# Altium schematic sheet MIXR Power - 5V & 3V3 Regulators.SchDoc: MIXR Power - +5V, 3V3, -5V Regulators
size B; Organization: Midnight Sun Solar Rayce Car Team; Address1: University of Waterloo; Address2: 200 University Ave W; Address3: Waterloo, ON, Canada; Address4: N2L 3E9; DocumentNumber: 6; SheetNumber: 6; SheetTotal: 8; Website: www.uwmidsun.com; ProjectName: ProjectName
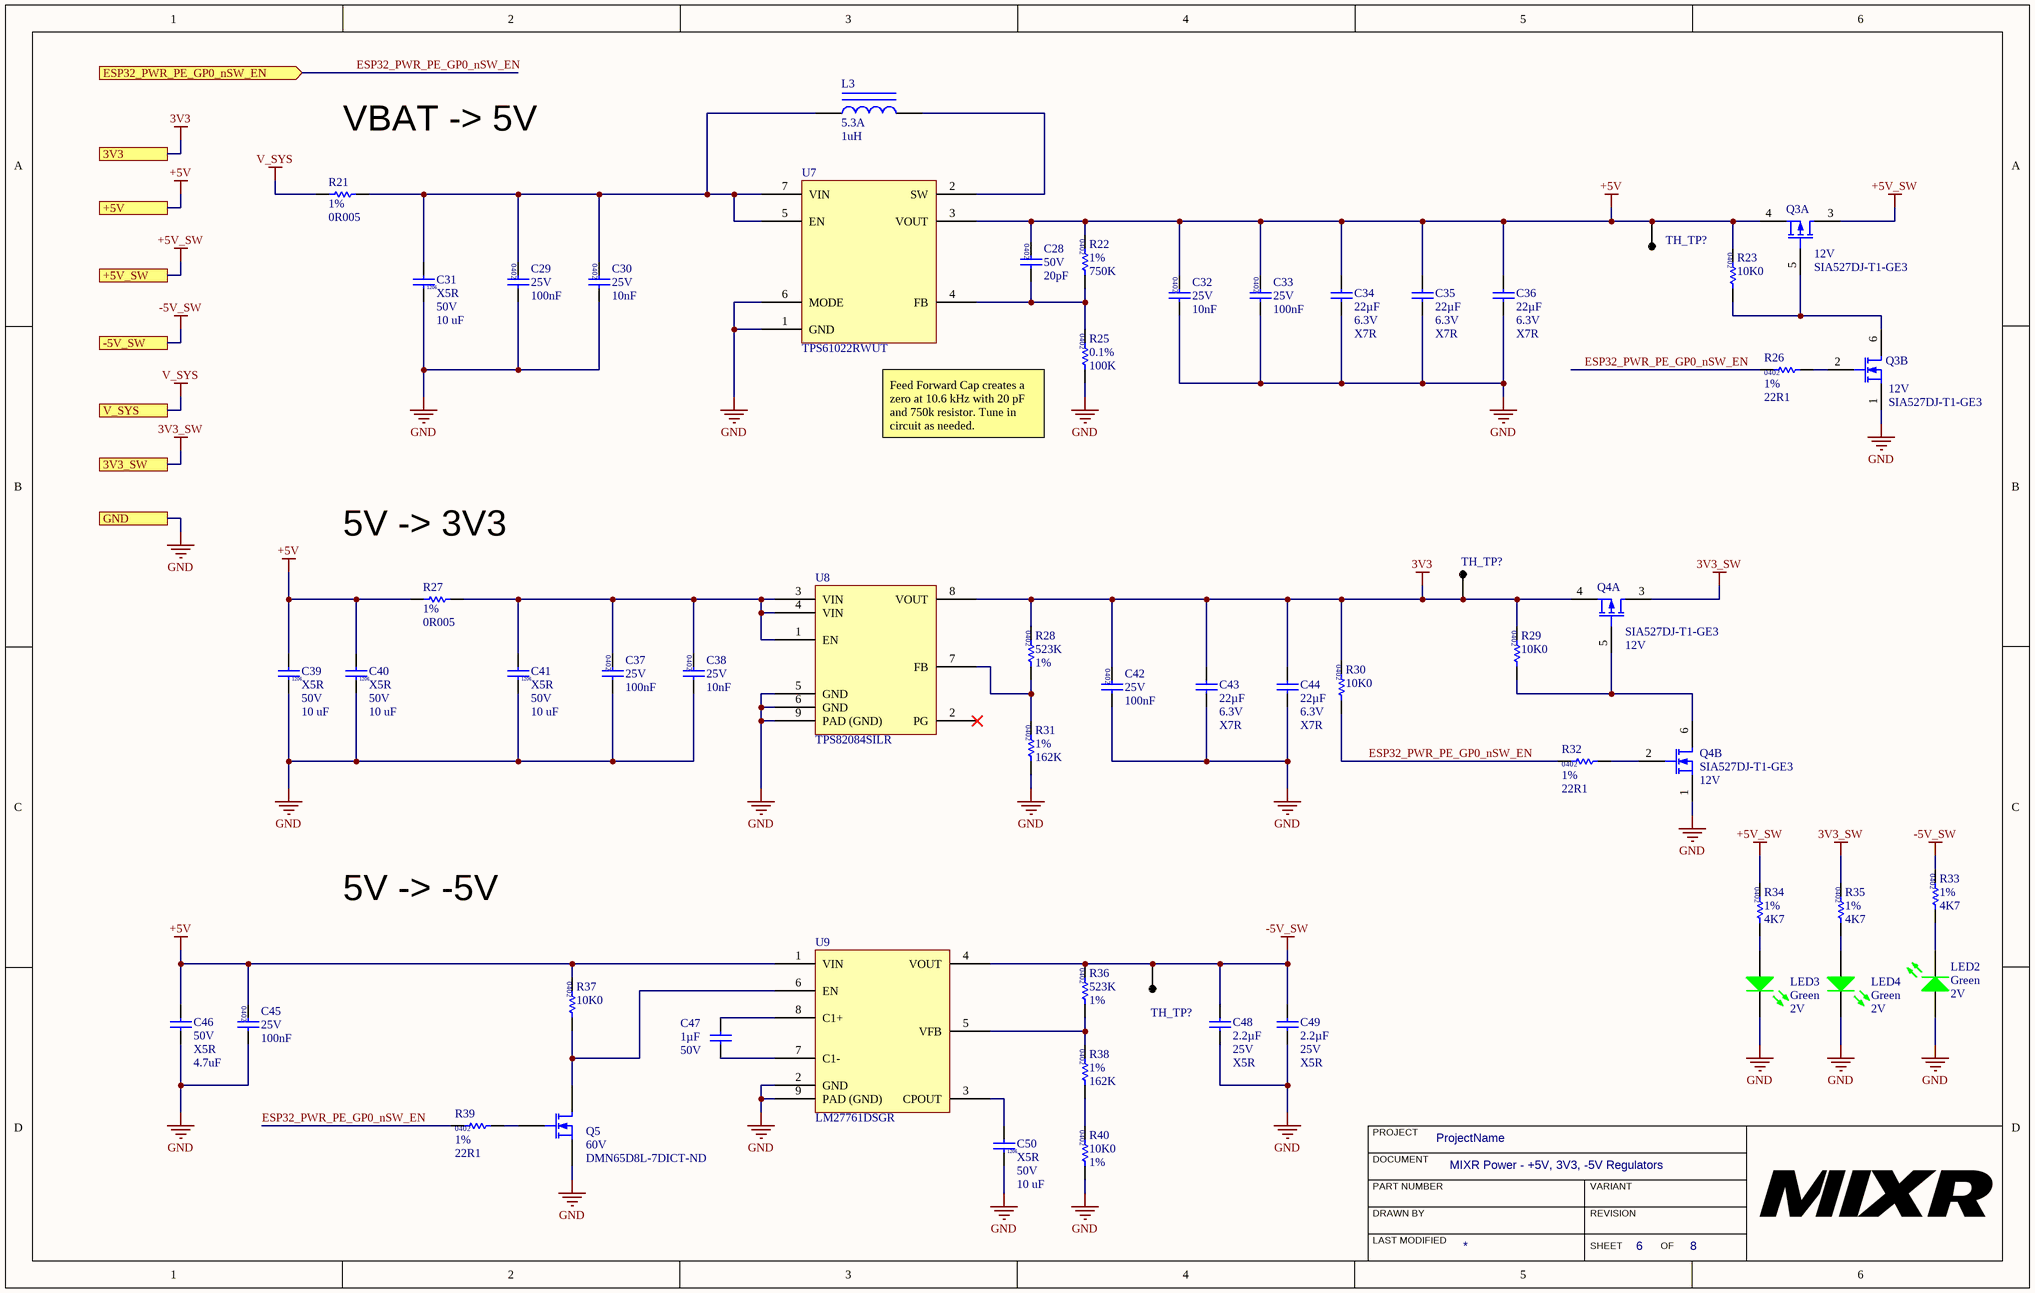
[diagram p0: MIXR Power - 5V & 3V3 Regulators.SchDoc]

## Parts
(Parts that share a designator on the sheet are numbered #1, #2 ... from top to bottom, then left to right.)
C28  Voltage Rating: 50V  Capacitance: 20pF  [CAP 0402]  (hidden comment: CAP CER 20PF 50V C0G/NPO 0402)
C29  Voltage: 25V  Capacitance: 100nF  [CAP 0402]  (hidden comment: CAP CER 0.1UF 16V X7R 0402)
C30  Voltage Rating: 25V  Capacitance: 10nF  [CAP 0402]  (hidden comment: CAP CER 10nF 25V X7R 0402)
C31  Rating: X5R  Voltage Rating: 50V  Capacitance: 10 uF  [CAP, 1206]  (hidden comment: CAP CER 10uF 50V 20% X5R 1206)
C32  Voltage Rating: 25V  Capacitance: 10nF  [CAP 0402]  (hidden comment: CAP CER 10nF 25V X7R 0402)
C33  Voltage: 25V  Capacitance: 100nF  [CAP 0402]  (hidden comment: CAP CER 0.1UF 16V X7R 0402)
C34  Capacitance: 22µF  Voltage: 6.3V  Temperature Coefficient: X7R  [CAP, 1206]  (hidden comment: CAP CER 22UF 6.3V ±10% X7R 1206)
C35  Capacitance: 22µF  Voltage: 6.3V  Temperature Coefficient: X7R  [CAP, 1206]  (hidden comment: CAP CER 22UF 6.3V ±10% X7R 1206)
C36  Capacitance: 22µF  Voltage: 6.3V  Temperature Coefficient: X7R  [CAP, 1206]  (hidden comment: CAP CER 22UF 6.3V ±10% X7R 1206)
C37  Voltage: 25V  Capacitance: 100nF  [CAP 0402]  (hidden comment: CAP CER 0.1UF 16V X7R 0402)
C38  Voltage Rating: 25V  Capacitance: 10nF  [CAP 0402]  (hidden comment: CAP CER 10nF 25V X7R 0402)
C39  Rating: X5R  Voltage Rating: 50V  Capacitance: 10 uF  [CAP, 1206]  (hidden comment: CAP CER 10uF 50V 20% X5R 1206)
C40  Rating: X5R  Voltage Rating: 50V  Capacitance: 10 uF  [CAP, 1206]  (hidden comment: CAP CER 10uF 50V 20% X5R 1206)
C41  Rating: X5R  Voltage Rating: 50V  Capacitance: 10 uF  [CAP, 1206]  (hidden comment: CAP CER 10uF 50V 20% X5R 1206)
C42  Voltage: 25V  Capacitance: 100nF  [CAP 0402]  (hidden comment: CAP CER 0.1UF 16V X7R 0402)
C43  Capacitance: 22µF  Voltage: 6.3V  Temperature Coefficient: X7R  [CAP, 1206]  (hidden comment: CAP CER 22UF 6.3V ±10% X7R 1206)
C44  Capacitance: 22µF  Voltage: 6.3V  Temperature Coefficient: X7R  [CAP, 1206]  (hidden comment: CAP CER 22UF 6.3V ±10% X7R 1206)
C45  Voltage: 25V  Capacitance: 100nF  [CAP 0402]  (hidden comment: CAP CER 0.1UF 16V X7R 0402)
C46  value 4.7uF  Voltage - Rated: 50V  Temperature Coefficient: X5R  [CAP, 0805]  (hidden comment: CAP CER 4.7UF 50V 10% X5R 0805)
C47  Capacitance: 1µF  Voltage: 50V  [CAP, 0603]  (hidden comment: CAP CER 1UF 50V 10% X7R 0603)
C48  Capacitance: 2.2µF  Voltage: 25V  Temperature Coefficient: X5R  [CAP, 0603]  (hidden comment: CAP CER 2.2UF 25V 10% X5R 0603)
C49  Capacitance: 2.2µF  Voltage: 25V  Temperature Coefficient: X5R  [CAP, 0603]  (hidden comment: CAP CER 2.2UF 25V 10% X5R 0603)
C50  Rating: X5R  Voltage Rating: 50V  Capacitance: 10 uF  [CAP, 1206]  (hidden comment: CAP CER 10uF 50V 20% X5R 1206)
L3  Current Rating: 5.3A  Inductance: 1uH  [IND 1UH 5.3A 20 MOHM 5020]  (hidden comment: IND 1UH 5.3A 20 MOHM SMD)
LED2  Color: Green  Voltage - Forward (Vf) (Typ): 2V  [LED_0603]  (hidden comment: LED GREEN CLEAR 2V 0603)
LED3  Color: Green  Voltage - Forward (Vf) (Typ): 2V  [LED_0603]  (hidden comment: LED GREEN CLEAR 2V 0603)
LED4  Color: Green  Voltage - Forward (Vf) (Typ): 2V  [LED_0603]  (hidden comment: LED GREEN CLEAR 2V 0603)
Q3  Manufacturer Part Number: SIA527DJ-T1-GE3  Drain to Source Voltage (Vdss): 12V  [MOSFET N/P-CH 12V 4.5A SC-70-6]  (hidden comment: MOSFET N/P-CH 12V 4.5A SC-70-6)  (parts A,B of 2)
Q4  Manufacturer Part Number: SIA527DJ-T1-GE3  Drain to Source Voltage (Vdss): 12V  [MOSFET N/P-CH 12V 4.5A SC-70-6]  (hidden comment: MOSFET N/P-CH 12V 4.5A SC-70-6)  (parts A,B of 2)
Q5  Drain to Source Voltage (Vdss): 60V  Supplier Part Number 1: DMN65D8L-7DICT-ND  [SOT23]  (hidden comment: MOSFET N-CH 60V 310MA SOT23)
R21  Tolerance: 1%  Resistance: 0R005  [RES CRF0805]  (hidden comment: RES 0.005 OHM 1% 1/2W 0805)
R22  Tolerance: 1%  Resistance: 750K  [RES, 0603]  (hidden comment: RES 750K OHM 1% 1/16W 0402)
R23  Resistance: 10K0  [RES 0402]  (hidden comment: RES 10K OHM 1% 1/16W 0402)
R25  Tolerance: 0.1%  Resistance: 100K  [RES, 0603]  (hidden comment: RES 100K OHM 0.1% 1/16W 0402)
R26  Tolerance: 1%  Resistance: 22R1  [RES 0402]  (hidden comment: RES 22.1 OHM 1% 1/16W 0402)
R27  Tolerance: 1%  Resistance: 0R005  [RES CRF0805]  (hidden comment: RES 0.005 OHM 1% 1/2W 0805)
R28  Resistance: 523K  Tolerance: 1%  [RES 0402]  (hidden comment: RES 523K OHM 1% 1/16W 0402)
R29  Resistance: 10K0  [RES 0402]  (hidden comment: RES 10K OHM 1% 1/16W 0402)
R30  Resistance: 10K0  [RES 0402]  (hidden comment: RES 10K OHM 1% 1/16W 0402)
R31  Tolerance: 1%  Resistance: 162K  [RES 0402]  (hidden comment: RES 162K OHM 1% 1/16W 0402)
R32  Tolerance: 1%  Resistance: 22R1  [RES 0402]  (hidden comment: RES 22.1 OHM 1% 1/16W 0402)
R33  Tolerance: 1%  Resistance: 4K7  [RES 0402]  (hidden comment: RES 4.7K OHM 1% 1/10W 0402)
R34  Tolerance: 1%  Resistance: 4K7  [RES 0402]  (hidden comment: RES 4.7K OHM 1% 1/10W 0402)
R35  Tolerance: 1%  Resistance: 4K7  [RES 0402]  (hidden comment: RES 4.7K OHM 1% 1/10W 0402)
R36  Resistance: 523K  Tolerance: 1%  [RES 0402]  (hidden comment: RES 523K OHM 1% 1/16W 0402)
R37  Resistance: 10K0  [RES 0402]  (hidden comment: RES 10K OHM 1% 1/16W 0402)
R38  Tolerance: 1%  Resistance: 162K  [RES 0402]  (hidden comment: RES 162K OHM 1% 1/16W 0402)
R39  Tolerance: 1%  Resistance: 22R1  [RES 0402]  (hidden comment: RES 22.1 OHM 1% 1/16W 0402)
R40  Resistance: 10K0  Tolerance: 1%  [RES 0402]  (hidden comment: RES 10K OHM 1% 1/16W 0402)
TH_TP?#1  Thru Test Point  [Thru Test Point]  (value not drawn)
TH_TP?#2  Thru Test Point  [Thru Test Point]  (value not drawn)
TH_TP?#3  Thru Test Point  [Thru Test Point]  (value not drawn)
U7  Manufacturer Part Number: TPS61022RWUT  [IC REG BOOST 8A VQFN=HR]  (hidden comment: IC REG BOOST 8A VQFN)
U8  Manufacturer Part Number: TPS82084SILR  [IC DCDC 0.8-6V 2A 8-uSIP]  (hidden comment: IC DCDC 0.8-6V 2A 8-uSIP)
U9  Manufacturer Part Number: LM27761DSGR  [QFN50P200X200X80_HS-9M]  (hidden comment: IC REG INV CHARGE PUMP ADJ 8-WSON)

## Ports
3V3, 3V3_SW, +5V, +5V_SW, -5V_SW, ESP32_PWR_PE_GP0_nSW_EN (in), GND, V_SYS

## Nets
3V3: C42.1 C43.1 C44.1 Q4.4(S) R28.1 R29.1 R30.1 TH_TP?#2.TH_TP U8.8(VOUT) ; port 3V3
3V3_SW: Q4.3(D) R35.1 ; port 3V3_SW
+5V: C28.1 C32.1 C33.1 C34.1 C35.1 C36.1 C39.1 C40.1 C45.1 C46.1 Q3.4(S) R22.1 R23.1 R27.1 R37.1 TH_TP?#1.TH_TP U7.3(VOUT) U9.1(VIN) ; port +5V
+5V_SW: Q3.3(D) R34.1 ; port +5V_SW
-5V_SW: C48.1 C49.1 R33.1 R36.1 TH_TP?#3.TH_TP U9.4(VOUT) ; port -5V_SW
GND: C29.2 C30.2 C31.2 C32.2 C33.2 C34.2 C35.2 C36.2 C37.2 C38.2 C39.2 C40.2 C41.2 C42.2 C43.2 C44.2 C45.2 C46.2 C48.2 C49.2 C50.2 LED2.1(A) LED3.2(K) LED4.2(K) Q3.1(S) Q4.1(S) Q5.2(S) R25.2 R31.2 R40.2 U7.1(GND) U7.6(MODE) U8.5(GND) U8.6(GND) U8.9(PAD_(GND)) U9.2(GND) U9.9(PAD_(GND)) ; port GND
V_SYS: R21.1 ; port V_SYS
ESP32_PWR_PE_GP0_nSW_EN: R26.1 R30.2 R32.1 R39.1 ; port ESP32_PWR_PE_GP0_nSW_EN
NetC28_2: C28.2 R22.2 R25.1 U7.4(FB)
NetC29_1: C29.1 C30.1 C31.1 L3.1 R21.2 U7.5(EN) U7.7(VIN)
NetC37_1: C37.1 C38.1 C41.1 R27.2 U8.1(EN) U8.3(VIN) U8.4(VIN)
NetC47_1: C47.1 U9.8(C1+)
NetC47_2: C47.2 U9.7(C1-)
NetC50_1: C50.1 U9.3(CPOUT)
NetL3_2: L3.2 U7.2(SW)
NetLED2_2: LED2.2(K) R33.2
NetLED3_1: LED3.1(A) R34.2
NetLED4_1: LED4.1(A) R35.2
NetQ3_2: Q3.2(G) R26.2
NetQ3_5: Q3.5(G2) Q3.6(D) R23.2
NetQ4_2: Q4.2(G) R32.2
NetQ4_5: Q4.5(G2) Q4.6(D) R29.2
NetQ5_1: Q5.1(D) R37.2 U9.6(EN)
NetQ5_3: Q5.3(G) R39.2
NetR28_2: R28.2 R31.1 U8.7(FB)
NetR36_2: R36.2 R38.1 U9.5(VFB)
NetR38_2: R38.2 R40.1

Not connected (* = marked no-connect by the designer): U8 2(PG)*

## Notes on the sheet
- VBAT -> 5V
- Feed Forward Cap creates a zero at 10.6 kHz with 20 pF and 750k resistor. Tune in circuit as needed.
- 5V -> 3V3
- 5V -> -5V
- PROJECT
- DOCUMENT
- DRAWN BY
- LAST MODIFIED
- PART NUMBER
- REVISION
- SHEET
- VARIANT
- OF

## Library data of the parts
C28 = CAP CER 20PF 50V C0G/NPO 0402: Cap Ceramic 20pF 50V C0G 5% SMD 0402 125C Paper T/R; Manufacturer: Samsung; Manufacturer Part Number: CL05C200JB5NNNC; Supplier 1: Digi-Key; RoHS: Yes; Category: Ceramic Capacitors; Stock 1: 2241047; Pricing 1: 1=0.10000, 10=0.03300, 100=0.01480, 500=0.01058, 1000=0.00831, 2500=0.00755, 5000=0.00695 (USD); Mount: Surface Mount; Case/Package: 0402; Case Code (Metric): 1005; Case Code (Imperial): 0402; Contact Plating: Tin; Min Operating Temperature: -55°C; Max Operating Temperature: 125°C; Tolerance: 5%; Package Quantity: 1; Packaging: Tape and Reel; Dielectric: C0G; Length: 1mm; Height: 0.5mm; Width: 0.02inch; Thickness: 0.022inch; Depth: 0.5mm; Radiation Hardening: No; ComponentLink1URL: https://datasheet.ciiva.com/25782/cl05c200jb5nnnc-25782785.pdf?src-supplier=Digi-Key; ComponentLink1Description: https://datasheet.ciiva.com/25782/cl05c200jb5nnnc-25782785.pdf?src-supplier=Digi-Key; ComponentLink2URL: https://datasheet.ciiva.com/16428/cl05c200jb5nnnc-16428806.pdf?src-supplier=Future+Electronics; ComponentLink2Description: https://datasheet.ciiva.com/16428/cl05c200jb5nnnc-16428806.pdf?src-supplier=Future+Electronics; ComponentLink3URL: https://datasheet.ciiva.com/26838/getdatasheetpartid-729190-26838291.pdf?src-supplier=Verical; ComponentLink3Description: https://datasheet.ciiva.com/26838/getdatasheetpartid-729190-26838291.pdf?src-supplier=Verical; Supplier Part Number 1: 1276-1661-1-ND
C29 C33 C37 C42 C45 = CAP CER 0.1UF 16V X7R 0402: Cap Ceramic 0.1uF 25V X7R 10% SMD 0402 125C Paper T/R; Manufacturer: Murata; Manufacturer Part Number: GRM155R71E104KE14D; Supplier 1: Digi-Key; RoHS: Yes; Category: Ceramic Capacitors; Stock 1: 785540; Pricing 1: 1=0.10000, 10=0.03400, 100=0.01520, 500=0.01088, 1000=0.00855, 2500=0.00778, 5000=0.00715 (USD); Mount: Surface Mount; Case/Package: 0402; Weight: 0.000212oz; Case Code (Metric): 1005; Case Code (Imperial): 0402; Dielectric Material: Ceramic; Min Operating Temperature: -55°C; Max Operating Temperature: 125°C; Packaging: Tape and Reel; Tolerance: 10%; Termination: SMD/SMT; Composition: Ceramic; Package Quantity: 10000; Length: 1mm; Height: 0.5mm; Width: 0.02inch; Thickness: 0.022inch; Depth: 0.5mm; REACH SVHC: Unknown; Lead Free: Lead Free; ComponentLink1URL: http://www.farnell.com/datasheets/2048008.pdf?src-supplier=Farnell; ComponentLink1Description: http://www.farnell.com/datasheets/2048008.pdf?src-supplier=Farnell; ComponentLink2URL: http://uk.rs-online.com/webdocs/144c/0900766b8144c113.pdf?src-supplier=RSComponents; ComponentLink2Description: http://uk.rs-online.com/webdocs/144c/0900766b8144c113.pdf?src-supplier=RSComponents; ComponentLink3URL: http://www.farnell.com/datasheets/1872206.pdf?src-supplier=Farnell; ComponentLink3Description: http://www.farnell.com/datasheets/1872206.pdf?src-supplier=Farnell; ComponentLink4URL: http://components.arrow.com/part/dataview/0323_06361249?src-supplier=Arrow+Europe; ComponentLink4Description: http://components.arrow.com/part/dataview/0323_06361249?src-supplier=Arrow+Europe; ComponentLink5URL: http://www.mouser.com/ds/2/281/c02e-2905.pdf?src-supplier=Mouser; ComponentLink5Description: http://www.mouser.com/ds/2/281/c02e-2905.pdf?src-supplier=Mouser; ComponentLink6URL: http://www.farnell.com/datasheets/2048008.pdf?src-supplier=Newark; ComponentLink6Description: http://www.farnell.com/datasheets/2048008.pdf?src-supplier=Newark; ComponentLink7URL: http://psearch.en.murata.com/capacitor/product/GRM155R71E104KE14%23.pdf?src-supplier=Avnet; ComponentLink7Description: http://psearch.en.murata.com/capacitor/product/GRM155R71E104KE14%23.pdf?src-supplier=Avnet; ComponentLink8URL: https://search.murata.co.jp/Ceramy/image/img/A01X/G101/ENG/GRM155R71E104KE14-01.pdf?src-supplier=Digi-Key; ComponentLink8Description: https://search.murata.co.jp/Ceramy/image/img/A01X/G101/ENG/GRM155R71E104KE14-01.pdf?src-supplier=Digi-Key; ComponentLink9URL: http://www.farnell.com/datasheets/2048008.pdf?src-supplier=Element14; ComponentLink9Description: http://www.farnell.com/datasheets/2048008.pdf?src-supplier=Element14; Supplier Part Number 1: 490-10698-1-ND; Dielectric: X7R; Voltage Rating (DC): 25V; Voltage Rating: 25V
C30 C32 C38 = CAP CER 10nF 25V X7R 0402: MURATA - GCM155R71E103KA37D - SMD Vícevrstvý Keramický Kondenzátor, 10000 pF, 25 V, 0402 [1005 Metrické], ± 10%, X7R, Série GCM; Supplier 1: Digi-Key; Manufacturer: Murata; Manufacturer Part Number: GCM155R71E103KA37D; RoHS: Yes; Category: Ceramic Capacitors; Stock 1: 4613622; Pricing 1: 1=0.10000, 10=0.04700, 100=0.02080, 500=0.01488, 1000=0.01169, 2500=0.01063, 5000=0.00978 (USD); Mount: Surface Mount; Case/Package: 0402; Case Code (Metric): 1005; Case Code (Imperial): 0402; Min Operating Temperature: -55°C; Max Operating Temperature: 125°C; Package Quantity: 1; Tolerance: 10%; Packaging: Tape and Reel; Dielectric: X7R; Termination: SMD/SMT; Voltage: 25V; Voltage Rating (DC): 25V; Length: 1mm; Height: 0.5mm; Width: 0.02inch; Thickness: 0.022inch; Depth: 0.5mm; Ratings: AEC-Q200; Radiation Hardening: No; REACH SVHC: No SVHC; Lead Free: Lead Free; ComponentLink1URL: https://datasheet.ciiva.com/26889/getdatasheetpartid-712285-26889130.pdf?src-supplier=Verical; ComponentLink1Description: https://datasheet.ciiva.com/26889/getdatasheetpartid-712285-26889130.pdf?src-supplier=Verical; ComponentLink2URL: https://datasheet.ciiva.com/11787/0900766b80ef92d0-11787083.pdf?src-supplier=RSComponents; ComponentLink2Description: https://datasheet.ciiva.com/11787/0900766b80ef92d0-11787083.pdf?src-supplier=RSComponents; ComponentLink3URL: https://datasheet.ciiva.com/6270/s0717e-6270940.pdf?src-supplier=Digi-Key; ComponentLink3Description: https://datasheet.ciiva.com/6270/s0717e-6270940.pdf?src-supplier=Digi-Key; ComponentLink4URL: https://datasheet.ciiva.com/6270/s0717e-6270942.pdf?src-supplier=Digi-Key; ComponentLink4Description: https://datasheet.ciiva.com/6270/s0717e-6270942.pdf?src-supplier=Digi-Key; Supplier Part Number 1: 490-6043-1-ND
C31 C39-C41 C50 = CAP CER 10uF 50V 20% X5R 1206: 10µF ±20% 50V Ceramic Capacitor X5R 1206 (3216 Metric) /; Manufacturer: Murata; Manufacturer Part Number: GRT31CR61H106ME01L; Supplier 1: Digi-Key; Supplier Part Number 1: 490-12457-1-ND; RoHS: Yes; Stock 1: 449467; Pricing 1: 1 = 0.57000, 10 = 0.39800, 100 = 0.23910, 500 = 0.17930, 1000 = 0.15141 (USD); Mount: Surface Mount; Case/Package: 1206; Case Code (Metric): 3216; Case Code (Imperial): 1206; Min Operating Temperature: -55°C; Max Operating Temperature: 85°C; Packaging: Tape and Reel; Tolerance: 20%; Length: 0.126inch; Width: 0.063inch; Thickness: 0.071inch; Ratings: AEC-Q200
C34-C36 C43 C44 = CAP CER 22UF 6.3V ±10% X7R 1206: 22µF ±10% 6.3V Ceramic Capacitor X7R 1206 (3216 Metric); Manufacturer 1: Murata Electronics North America; Manufacturer Part Number 1: GRM31CR70J226KE19L; Supplier 1: Digi-Key; Supplier Part Number 1: 490-6515-1-ND; Packaging: Cut Tape (CT); Part Status: Active; Operating Temperature: -55°C ~ 125°C; Ratings: -; Mounting Type: Surface Mount, MLCC; Package / Case: 1206 (3216 Metric); Size / Dimension: 0.126" L x 0.063" W (3.20mm x 1.60mm); Height - Seated (Max): -; Thickness (Max): 0.071" (1.80mm); Lead Spacing: -; Lead Style: -; ComponentLink1URL: http://www.murata.com/~/media/webrenewal/support/library/catalog/products/capacitor/mlcc/c02e.ashx; ComponentLink1Description: http://www.murata.com/~/media/webrenewal/support/library/catalog/products/capacitor/mlcc/c02e.ashx; Tolerance: ±10%
C46 = CAP CER 4.7UF 50V 10% X5R 0805: 4.7µF ±20% 50V Ceramic Capacitor X5R 0805 (2012 Metric); Manufacturer 1: Murata Electronics North America; Manufacturer Part Number 1: GRT21BR61H475ME13L; Description 1: CAP CER 4.7UF 50V X5R 0805; Supplier 1: Digi-Key; Supplier Part Number 1: 490-12395-1-ND; RoHS: RoHS Compliant; Category: Capacitors; Stock 1: 4286; Pricing 1: 1=0.56, 10=0.389, 100=0.2338, 500=0.17536, 1000=0.14808 (CAD); Packaging: Cut Tape (CT); Part Status: Active; Tolerance: ±20%; Operating Temperature: -55°C ~ 85°C; Features: -; Ratings: AEC-Q200; Applications: Automotive; Mounting Type: Surface Mount, MLCC; Package / Case: 0805 (2012 Metric); Size / Dimension: 0.079" L x 0.049" W (2.00mm x 1.25mm); Height - Seated (Max): -; Thickness (Max): 0.057" (1.45mm); Lead Spacing: -; Lead Style: -; ComponentLink1URL: http://search.murata.co.jp/Ceramy/image/img/A01X/G101/ENG/GRT21BR61H475ME13-01.pdf; ComponentLink1Description: http://search.murata.co.jp/Ceramy/image/img/A01X/G101/ENG/GRT21BR61H475ME13-01.pdf
C47 = CAP CER 1UF 50V 10% X7R 0603: 1µF ±10% 50V Ceramic Capacitor X7R 0603 (1608 Metric); Manufacturer 1: Taiyo Yuden; Manufacturer Part Number 1: UMK107AB7105KA-T; Supplier 1: Digi-Key; Supplier Part Number 1: 587-3247-1-ND; Packaging: Cut Tape (CT); Part Status: Active; Operating Temperature: -55°C ~ 125°C; Ratings: -; Mounting Type: Surface Mount, MLCC; Package / Case: 0603 (1608 Metric); Size / Dimension: 0.063" L x 0.031" W (1.60mm x 0.80mm); Height - Seated (Max): -; Thickness (Max): 0.037" (0.95mm); Lead Spacing: -; Lead Style: -; ComponentLink1URL: http://www.yuden.co.jp/productdata/catalog/en/mlcc_all_e.pdf; ComponentLink1Description: http://www.yuden.co.jp/productdata/catalog/en/mlcc_all_e.pdf; Tolerance: ±10%; Temperature Coefficient: X7R
C48 C49 = CAP CER 2.2UF 25V 10% X5R 0603: 2.2µF ±10% 25V Ceramic Capacitor X5R 0603 (1608 Metric); Manufacturer 1: Murata Electronics North America; Manufacturer Part Number 1: GRM188R61E225KA12D; Supplier 1: Digi-Key; Supplier Part Number 1: 490-10731-1-ND; Packaging: Cut Tape (CT); Part Status: Active; Operating Temperature: -55°C ~ 85°C; Ratings: -; Mounting Type: Surface Mount, MLCC; Package / Case: 0603 (1608 Metric); Size / Dimension: 0.063" L x 0.031" W (1.60mm x 0.80mm); Height - Seated (Max): -; Thickness (Max): 0.035" (0.90mm); Lead Spacing: -; Lead Style: -; ComponentLink1URL: http://www.murata.com/~/media/webrenewal/support/library/catalog/products/capacitor/mlcc/c02e.ashx; ComponentLink1Description: http://www.murata.com/~/media/webrenewal/support/library/catalog/products/capacitor/mlcc/c02e.ashx; Tolerance: ±10%
L3 = IND 1UH 5.3A 20 MOHM SMD: WURTH ELEKTRONIK         74437334010             Surface Mount Power Inductor, WE-LHMI Series, 1 H, 5.3 A, 13.9 A, Shielded, 0.02 ohm; Manufacturer: Wurth Electronics; Core Material: Ferrite; Saturation Current: 13.9A; DC Resistance (DCR): 20mR; Self Resonant Frequency: 65MHz; Test Frequency: 100kHz; Tolerance: 20%; Supplier 1: Digi-Key; Manufacturer Part Number: 74437334010; RoHS: Yes; Category: Fixed Inductors; Stock 1: 2869; Pricing 1: 1=2.39000, 50=2.21400, 100=2.01300, 250=1.83000, 500=1.66300 (USD); Mount: Surface Mount; Case/Package: SMD/SMT; Number of Pins: 2; Min Operating Temperature: -40°C; Max Operating Temperature: 125°C; Packaging: Cut Tape; Composition: Wirewound; Shielding: Shielded; RMS Current (Irms): 5.3A; Inductance Tolerance: 20%; Length: 0.205inch; Width: 0.205inch; Height - Seated (Max): 0.079inch; REACH SVHC: Unknown; ComponentLink1URL: http://www.farnell.com/datasheets/1880894.pdf?src-supplier=Farnell; ComponentLink1Description: http://www.farnell.com/datasheets/1880894.pdf?src-supplier=Farnell; ComponentLink2URL: http://www.farnell.com/datasheets/1880894.pdf?src-supplier=Element14; ComponentLink2Description: http://www.farnell.com/datasheets/1880894.pdf?src-supplier=Element14; Supplier Part Number 1: 732-6149-1-ND
LED2-LED4 = LED GREEN CLEAR 2V 0603: Green 572nm LED Indication - Discrete 2V 0603 (1608 Metric); Manufacturer: Wurth Electronics Inc.; Manufacturer Part Number: 150060VS75000; Lens Color: Colorless; Millicandela Rating: 40mcd; Lens Style/Size: Rectangle with Flat Top, 1.10mm x 0.70mm; Current - Test: 20mA; Viewing Angle: 140°; Wavelength - Dominant: 570nm; Supplier 1: Digi-Key; RoHS: RoHS Compliant; Category: Optoelectronics; Stock 1: 9408; Pricing 1: 1=0.21, 100=0.1617, 500=0.13964 (CAD); Packaging: Cut Tape (CT); Part Status: Active; Lens Transparency: Clear; Mounting Type: Surface Mount; Wavelength - Peak: 572nm; Features: -; Package / Case: 0603 (1608 Metric); Supplier Device Package: 0603; Size / Dimension: 1.60mm L x 0.80mm W; Height (Max): 0.80mm; ComponentLink1URL: http://katalog.we-online.de/led/datasheet/150060VS75000.pdf; ComponentLink1Description: http://katalog.we-online.de/led/datasheet/150060VS75000.pdf; Supplier Part Number 1: 732-4980-1-ND
Q3 Q4 = MOSFET N/P-CH 12V 4.5A SC-70-6: MOSFET 12V 29mOhm@4.5V 4.5A N-CH; Manufacturer: Vishay Semiconductors; Rise Time: 10ns; Rds On Max: 29mR; Input Capacitance: 500pF; Resistance: 0.00071R; Max Power Dissipation: 7.8W; Number of Channels: 2; Gate to Source Voltage (Vgs): 8V; Turn-Off Delay Time: 22ns; Element Configuration: Dual; FET Type: N and P-Channel; Drain to Source Resistance: 41mR; Supplier 1: Digi-Key; RoHS: Yes; Category: MOSFETs; Stock 1: 14908; Pricing 1: 1=0.54000, 10=0.46400, 100=0.32140, 500=0.25090, 1000=0.20394 (USD); Mount: Surface Mount; Min Operating Temperature: -55°C; Max Operating Temperature: 150°C; Packaging: Tape and Reel; Package Quantity: 3000; Continuous Drain Current (ID): 4.5A; Drain to Source Breakdown Voltage: 12V; Fall Time: 10ns; Turn-On Delay Time: 10ns; ComponentLink1URL: https://datasheet.ciiva.com/24094/sia527dj-267652-24094820.pdf?src-supplier=Mouser; ComponentLink1Description: https://datasheet.ciiva.com/24094/sia527dj-267652-24094820.pdf?src-supplier=Mouser; ComponentLink2URL: https://datasheet.ciiva.com/29589/sia527dj-29589668.pdf?src-supplier=Digi-Key; ComponentLink2Description: https://datasheet.ciiva.com/29589/sia527dj-29589668.pdf?src-supplier=Digi-Key; ComponentLink3URL: https://datasheet.ciiva.com/29589/sia527dj-29589669.pdf?src-supplier=Digi-Key; ComponentLink3Description: https://datasheet.ciiva.com/29589/sia527dj-29589669.pdf?src-supplier=Digi-Key; ComponentLink4URL: https://datasheet.ciiva.com/29589/sia527dj-29589670.pdf?src-supplier=Digi-Key; ComponentLink4Description: https://datasheet.ciiva.com/29589/sia527dj-29589670.pdf?src-supplier=Digi-Key; Supplier Part Number 1: SIA527DJ-T1-GE3CT-ND
Q5 = MOSFET N-CH 60V 310MA SOT23: N-Channel 60V 310mA (Ta) 370mW (Ta) Surface Mount SOT-23; Manufacturer: Diodes; Manufacturer Part Number: DMN6140L-7; Rds On Max: 140mR; Input Capacitance: 315pF; Continuous Drain Current (ID): 1.6A; Threshold Voltage: 3V; Element Configuration: Single; Number of Channels: 1; Gate to Source Voltage (Vgs): 20V; Fall Time: 2.7ns; Rise Time: 3.6ns; Turn-Off Delay Time: 16.3ns; Turn-On Delay Time: 2.6ns; Power Dissipation: 540mW; FET Type: 1 N-Channel; Max Power Dissipation: 700mW; Mount: Surface Mount; Case/Package: TO-236-3; Number of Pins: 3; Weight: 0.000282oz; Min Operating Temperature: -55°C; Max Operating Temperature: 150°C; Package Quantity: 3000; Packaging: Tape and Reel; Drain to Source Resistance: 140mR; REACH SVHC: No SVHC; Lead Free: Lead Free; ComponentLink1URL: https://datasheet.ciiva.com/29747/dmn6140l-29747654.pdf; ComponentLink1Description: https://datasheet.ciiva.com/29747/dmn6140l-29747654.pdf; ComponentLink2URL: https://datasheet.ciiva.com/29747/dmn6140l-29747660.pdf; ComponentLink2Description: https://datasheet.ciiva.com/29747/dmn6140l-29747660.pdf; Supplier 1: Digi-Key; Stock 1: 0; Drain to Source Breakdown Voltage: 60V; Number of Elements: 1; Length: 3mm; Height: 1.1mm; Width: 1.4mm; ComponentLink3URL: https://datasheet.ciiva.com/6371/dmn65d8l-6371124.pdf; ComponentLink3Description: https://datasheet.ciiva.com/6371/dmn65d8l-6371124.pdf; ComponentLink4URL: https://datasheet.ciiva.com/6371/dmn65d8l-6371126.pdf; ComponentLink4Description: https://datasheet.ciiva.com/6371/dmn65d8l-6371126.pdf; ComponentLink5URL: https://datasheet.ciiva.com/13058/dmn65d8l-219098-13058455.pdf; ComponentLink5Description: https://datasheet.ciiva.com/13058/dmn65d8l-219098-13058455.pdf; ComponentLink6URL: https://datasheet.ciiva.com/6371/dmn65d8l-6371128.pdf; ComponentLink6Description: https://datasheet.ciiva.com/6371/dmn65d8l-6371128.pdf
R21 R27 = RES 0.005 OHM 1% 1/2W 0805: 5 mOhms ±1% 0.5W, 1/2W Chip Resistor 0805 (2012 Metric) Automotive AEC-Q200, Current Sense, Moisture Resistant Metal Element; Manufacturer: Bourns; Manufacturer Part Number: CRF0805-FZ-R005ELF; Power Rating: 500mW; Temperature Coefficient: 75ppm/°C; Supplier 1: Digi-Key; RoHS: Yes; Category: Chip SMD Resistors; Stock 1: 12417; Pricing 1: 1=0.54000, 10=0.41700, 100=0.17550, 1000=0.09680, 2500=0.09075 (USD); Case/Package: 0805; Weight: 0.000194oz; Case Code (Imperial): 0805; Case Code (Metric): 2012; Min Operating Temperature: -55°C; Max Operating Temperature: 170°C; Packaging: Tape and Reel; Package Quantity: 5000; Composition: Metal Film; Number of Terminations: 2; Termination: SMD/SMT; Max Power Dissipation: 500mW; Features: Moisture Resistant,Automotive AEC-Q200; Length: 0.079inch; Height: 0.6mm; Width: 0.049inch; Height - Seated (Max): 0.031inch; ComponentLink1URL: http://www.farnell.com/datasheets/2194442.pdf?src-supplier=Farnell; ComponentLink1Description: http://www.farnell.com/datasheets/2194442.pdf?src-supplier=Farnell; ComponentLink2URL: http://www.mouser.com/ds/2/54/rf-937137.pdf?src-supplier=Mouser; ComponentLink2Description: http://www.mouser.com/ds/2/54/rf-937137.pdf?src-supplier=Mouser; ComponentLink3URL: http://www.farnell.com/datasheets/2194442.pdf?src-supplier=Newark; ComponentLink3Description: http://www.farnell.com/datasheets/2194442.pdf?src-supplier=Newark; ComponentLink4URL: https://www.bourns.com/docs/Product-Datasheets/CRF.pdf?src-supplier=Digi-Key; ComponentLink4Description: https://www.bourns.com/docs/Product-Datasheets/CRF.pdf?src-supplier=Digi-Key; Supplier Part Number 1: CRF0805-FZ-R005ELFCT-ND
R22 = RES 750K OHM 1% 1/16W 0402: 750 kOhms ±1% 0.063W, 1/16W Chip Resistor 0402 (1005 Metric) Moisture Resistant Thick Film; Manufacturer: Yageo; Manufacturer Part Number: RC0402FR-07750KL; Power Rating: 63mW; Voltage Rating: 50V; Temperature Coefficient: 100ppm/°C; Supplier 1: Digi-Key; RoHS: Yes; Category: Chip SMD Resistors; Stock 1: 365336; Pricing 1: 1=0.10000, 10=0.01600, 100=0.00640, 1000=0.00289, 2500=0.00251, 5000=0.00207 (USD); Case/Package: 0402; Case Code (Imperial): 0402; Case Code (Metric): 1005; Contact Plating: Tin,Matte; Min Operating Temperature: -55°C; Max Operating Temperature: 155°C; Packaging: Tape and Reel; Composition: Thick Film; Number of Terminations: 2; Termination: SMD/SMT; Military Standard: Not; Max Power Dissipation: 63mW; Voltage Rating (DC): 50V; Features: Moisture Resistant; Length: 1mm; Height: 0.016inch; Width: 0.02inch; Depth: 0.5mm; REACH SVHC: Unknown; Lead Free: Lead Free; ComponentLink1URL: https://datasheet.ciiva.com/7850/1018594-7850087.pdf?src-supplier=Element14; ComponentLink1Description: https://datasheet.ciiva.com/7850/1018594-7850087.pdf?src-supplier=Element14; ComponentLink2URL: https://datasheet.ciiva.com/28388/pyu-rc0402-51-rohs-l-6-28388151.pdf?src-supplier=Avnet+Europe; ComponentLink2Description: https://datasheet.ciiva.com/28388/pyu-rc0402-51-rohs-l-6-28388151.pdf?src-supplier=Avnet+Europe; ComponentLink3URL: https://datasheet.ciiva.com/7850/1018594-7850088.pdf?src-supplier=Element14; ComponentLink3Description: https://datasheet.ciiva.com/7850/1018594-7850088.pdf?src-supplier=Element14; ComponentLink4URL: https://datasheet.ciiva.com/16858/pyu-rc0402-51-rohs-l-6-16858393.pdf?src-supplier=Avnet+Europe; ComponentLink4Description: https://datasheet.ciiva.com/16858/pyu-rc0402-51-rohs-l-6-16858393.pdf?src-supplier=Avnet+Europe; Supplier Part Number 1: YAG3228CT-ND
R23 R29 R30 R37 R40 = RES 10K OHM 1% 1/16W 0402: Surface Mount Thick Film Resistor, Rc Series, 10 Kohm, 62.5 Mw, - 1%, 50 V, 0402 [1005 Metric]; Manufacturer: Yageo; Manufacturer Part Number: RC0402FR-0710KL; Temperature Coefficient: 100ppm/°C; Voltage Rating: 50V; Power Rating: 62.5mW; Supplier 1: Digi-Key; Supplier Part Number 1: 311-10.0KLRCT-ND; Packaging: Tape and Reel; Composition: Thick Film; ComponentLink1URL: https://datasheet.ciiva.com/7660/38568-7660787.pdf?src-supplier=Element14; ComponentLink1Description: https://datasheet.ciiva.com/7660/38568-7660787.pdf?src-supplier=Element14; RoHS: Yes; Category: Chip SMD Resistors; Stock 1: 60761136; Pricing 1: 1=0.10000, 10=0.01600, 100=0.00640, 1000=0.00289, 2500=0.00251, 5000=0.00207 (USD); Case/Package: 0402; Number of Pins: 2; Case Code (Imperial): 0402; Case Code (Metric): 1005; Min Operating Temperature: -55°C; Max Operating Temperature: 155°C; Voltage Rating (DC): 50V; Termination: SMD/SMT; Military Standard: Not; Working Voltage: 50V; Number of Terminations: 2; Length: 1mm; Height: 0.32mm; Width: 0.5mm; Depth: 0.5mm; Lead Pitch: 0.2mm; REACH SVHC: No SVHC; Lead Free: Lead Free; ComponentLink2URL: https://datasheet.ciiva.com/7983/1018594-7983486.pdf?src-supplier=Element14; ComponentLink2Description: https://datasheet.ciiva.com/7983/1018594-7983486.pdf?src-supplier=Element14; ComponentLink3URL: https://datasheet.ciiva.com/7849/1784430-7849813.pdf?src-supplier=Element14; ComponentLink3Description: https://datasheet.ciiva.com/7849/1784430-7849813.pdf?src-supplier=Element14; ComponentLink4URL: https://datasheet.ciiva.com/7849/1686128-7849814.pdf?src-supplier=Element14; ComponentLink4Description: https://datasheet.ciiva.com/7849/1686128-7849814.pdf?src-supplier=Element14; ComponentLink5URL: https://datasheet.ciiva.com/7849/1784430-7849815.pdf?src-supplier=Element14; ComponentLink5Description: https://datasheet.ciiva.com/7849/1784430-7849815.pdf?src-supplier=Element14; ComponentLink6URL: https://datasheet.ciiva.com/22747/1018594-22747512.pdf?src-supplier=Element14; ComponentLink6Description: https://datasheet.ciiva.com/22747/1018594-22747512.pdf?src-supplier=Element14; ComponentLink7URL: https://datasheet.ciiva.com/12667/pyu-rc0402-51-rohs-l-6-r-12667067.pdf?src-supplier=Mouser; ComponentLink7Description: https://datasheet.ciiva.com/12667/pyu-rc0402-51-rohs-l-6-r-12667067.pdf?src-supplier=Mouser
  R23 R29 R30 R37: Tolerance: 1%
R25 = RES 100K OHM 0.1% 1/16W 0402: Thin Film Resistors - SMD 1/16W 100K ohm .1% 25ppm; Manufacturer: Yageo; Manufacturer Part Number: RT0402BRD07100KL; Power Rating: 62.5mW; Voltage Rating: 50V; Max Power Dissipation: 63mW; Temperature Coefficient: 25ppm/°C; Supplier 1: Digi-Key; RoHS: Yes; Category: Chip SMD Resistors; Stock 1: 83152; Pricing 1: 1=0.41000, 10=0.29200, 100=0.11690, 1000=0.05762, 2500=0.05338, 5000=0.04830 (USD); Case/Package: 0402; Case Code (Metric): 1005; Case Code (Imperial): 0402; Min Operating Temperature: -55°C; Max Operating Temperature: 125°C; Packaging: Tape and Reel; Composition: Thin Film; Number of Terminations: 2; Termination: SMD/SMT; Military Standard: Not; Voltage Rating (DC): 50V; Features: Moisture Resistant; Length: 0.039inch; Height: 0.014inch; Width: 0.02inch; Depth: 0.5mm; Lead Free: Lead Free; ComponentLink1URL: https://datasheet.ciiva.com/12724/pyu-rt-1-to-0-05-rohs-l-4-12724954.pdf?src-supplier=Mouser; ComponentLink1Description: https://datasheet.ciiva.com/12724/pyu-rt-1-to-0-05-rohs-l-4-12724954.pdf?src-supplier=Mouser; Supplier Part Number 1: YAG1343CT-ND
R26 R32 R39 = RES 22.1 OHM 1% 1/16W 0402: RES SMD 22.1 OHM 1% 1/16W 0402; Manufacturer: Yageo; Manufacturer Part Number: RC0402FR-0722R1L; Power Rating: 62.5mW; Voltage Rating: 50V; Temperature Coefficient: 100ppm/°C; Max Power Dissipation: 63mW; Supplier 1: Digi-Key; RoHS: Yes; Category: Chip SMD Resistors; Stock 1: 5073010; Pricing 1: 1=0.10000, 10=0.01600, 100=0.00640, 1000=0.00289, 2500=0.00251, 5000=0.00207 (USD); Case/Package: 0402; Case Code (Imperial): 0402; Case Code (Metric): 1005; Min Operating Temperature: -55°C; Max Operating Temperature: 155°C; Packaging: Tape and Reel; Package Quantity: 1; Termination: SMD/SMT; Composition: Thick Film; Number of Terminations: 2; Military Standard: Not; Features: Moisture Resistant; Voltage Rating (DC): 50V; Working Voltage: 50V; Length: 1mm; Height: 0.016inch; Width: 0.02inch; Depth: 0.5mm; Lead Free: Lead Free; REACH SVHC: No SVHC; ComponentLink1URL: https://datasheet.ciiva.com/11808/0900766b80c66297-11808453.pdf?src-supplier=RSComponents; ComponentLink1Description: https://datasheet.ciiva.com/11808/0900766b80c66297-11808453.pdf?src-supplier=RSComponents; ComponentLink2URL: https://datasheet.ciiva.com/16740/pyu-rc0402-51-rohs-l-6-r-16740855.pdf?src-supplier=Future+Electronics; ComponentLink2Description: https://datasheet.ciiva.com/16740/pyu-rc0402-51-rohs-l-6-r-16740855.pdf?src-supplier=Future+Electronics; ComponentLink3URL: https://datasheet.ciiva.com/2518/pyu-r-int-thick-7-2518970.pdf?src-supplier=Digi-Key; ComponentLink3Description: https://datasheet.ciiva.com/2518/pyu-r-int-thick-7-2518970.pdf?src-supplier=Digi-Key; ComponentLink4URL: https://datasheet.ciiva.com/2518/pyu-r-int-thick-7-2518971.pdf?src-supplier=Digi-Key; ComponentLink4Description: https://datasheet.ciiva.com/2518/pyu-r-int-thick-7-2518971.pdf?src-supplier=Digi-Key; ComponentLink5URL: https://datasheet.ciiva.com/2518/pyu-r-int-thick-7-2518972.pdf?src-supplier=Digi-Key; ComponentLink5Description: https://datasheet.ciiva.com/2518/pyu-r-int-thick-7-2518972.pdf?src-supplier=Digi-Key; Supplier Part Number 1: 311-22.1LRCT-ND
R28 R36 = RES 523K OHM 1% 1/16W 0402: Thick Film Resistors 523K OHM 1%; Manufacturer: Yageo; Manufacturer Part Number: RC0402FR-07523KL; Power Rating: 62.5mW; Voltage Rating: 50V; Temperature Coefficient: 100ppm/°C; Max Power Dissipation: 63mW; Supplier 1: Digi-Key; RoHS: Yes; Category: Chip SMD Resistors; Stock 1: 24455; Pricing 1: 1=0.10000, 10=0.01600, 100=0.00640, 1000=0.00289, 2500=0.00251, 5000=0.00207 (USD); Case/Package: 0402; Weight: 2.3E-05oz; Case Code (Imperial): 0402; Case Code (Metric): 1005; Contact Plating: Tin,Matte; Min Operating Temperature: -55°C; Max Operating Temperature: 155°C; Packaging: Tape and Reel; Composition: Thick Film; Termination: SMD/SMT; Number of Terminations: 2; Military Standard: Not; Voltage Rating (DC): 50V; Features: Moisture Resistant; Length: 1mm; Height: 0.016inch; Width: 0.5mm; Depth: 0.5mm; Lead Free: Lead Free; ComponentLink1URL: https://datasheet.ciiva.com/8885/pyu-rc0402-51-rohs-l-6-8885398.pdf?src-supplier=Avnet; ComponentLink1Description: https://datasheet.ciiva.com/8885/pyu-rc0402-51-rohs-l-6-8885398.pdf?src-supplier=Avnet; ComponentLink2URL: https://datasheet.ciiva.com/16867/pyu-rc0402-51-rohs-l-6-16867910.pdf?src-supplier=Avnet+Europe; ComponentLink2Description: https://datasheet.ciiva.com/16867/pyu-rc0402-51-rohs-l-6-16867910.pdf?src-supplier=Avnet+Europe; ComponentLink3URL: https://datasheet.ciiva.com/12577/pyu-rc0402-51-rohs-l-6-r-12577464.pdf?src-supplier=Mouser; ComponentLink3Description: https://datasheet.ciiva.com/12577/pyu-rc0402-51-rohs-l-6-r-12577464.pdf?src-supplier=Mouser; ComponentLink4URL: https://datasheet.ciiva.com/28389/pyu-rc0402-51-rohs-l-6-28389900.pdf?src-supplier=Avnet+Europe; ComponentLink4Description: https://datasheet.ciiva.com/28389/pyu-rc0402-51-rohs-l-6-28389900.pdf?src-supplier=Avnet+Europe; Supplier Part Number 1: YAG3177CT-ND
R31 R38 = RES 162K OHM 1% 1/16W 0402: RES SMD 162K OHM 1% 1/16W 0402; Manufacturer: Yageo; Manufacturer Part Number: RC0402FR-07162KL; Power Rating: 62.5mW; Voltage Rating: 50V; Temperature Coefficient: 100ppm/°C; Max Power Dissipation: 63mW; Supplier 1: Digi-Key; RoHS: Yes; Category: Chip SMD Resistors; Stock 1: 987661; Pricing 1: 1=0.10000, 10=0.01600, 100=0.00640, 1000=0.00289, 2500=0.00251, 5000=0.00207 (USD); Case/Package: 0402; Case Code (Imperial): 0402; Case Code (Metric): 1005; Contact Plating: Tin,Matte; Min Operating Temperature: -55°C; Max Operating Temperature: 155°C; Packaging: Tape and Reel; Package Quantity: 10000; Composition: Thick Film; Number of Terminations: 2; Termination: SMD/SMT; Military Standard: Not; Voltage Rating (DC): 50V; Features: Moisture Resistant; Length: 1mm; Height: 0.016inch; Width: 0.02inch; Depth: 0.5mm; Lead Free: Lead Free; ComponentLink1URL: https://datasheet.ciiva.com/2452/pyu-r-int-thick-7-2452605.pdf?src-supplier=Digi-Key; ComponentLink1Description: https://datasheet.ciiva.com/2452/pyu-r-int-thick-7-2452605.pdf?src-supplier=Digi-Key; ComponentLink2URL: https://datasheet.ciiva.com/16869/pyu-rc0402-51-rohs-l-6-16869191.pdf?src-supplier=Avnet+Europe; ComponentLink2Description: https://datasheet.ciiva.com/16869/pyu-rc0402-51-rohs-l-6-16869191.pdf?src-supplier=Avnet+Europe; Supplier Part Number 1: YAG2370CT-ND
R33-R35 = RES 4.7K OHM 1% 1/10W 0402: YAGEO (PHYCOMP) - RC0402FR-074K7L - RES, THICK FILM, 4K7, 1%, 0.063W, 0402; Voltage Rating (DC): 50V; Power Rating: 62.5mW; Temperature Coefficient: 100ppm/°C; Supplier 1: Digi-Key; Manufacturer: Yageo; Manufacturer Part Number: RC0402FR-074K7L; RoHS: Yes; Category: Chip SMD Resistors; Stock 1: 11223879; Pricing 1: 1=0.10000, 10=0.01600, 100=0.00640, 1000=0.00289, 2500=0.00251, 5000=0.00207 (USD); Case/Package: 0402; Number of Pins: 2; Case Code (Imperial): 0402; Case Code (Metric): 1005; Min Operating Temperature: -55°C; Max Operating Temperature: 155°C; Voltage Rating: 50V; Packaging: Tape and Reel; Composition: Thick Film; Termination: SMD/SMT; Military Standard: Not; Length: 1mm; Height: 0.32mm; Width: 0.5mm; Depth: 0.5mm; REACH SVHC: No SVHC; Lead Free: Lead Free; ComponentLink1URL: https://datasheet.ciiva.com/7850/1018594-7850022.pdf?src-supplier=Element14; ComponentLink1Description: https://datasheet.ciiva.com/7850/1018594-7850022.pdf?src-supplier=Element14; ComponentLink2URL: https://datasheet.ciiva.com/7850/1018594-7850023.pdf?src-supplier=Element14; ComponentLink2Description: https://datasheet.ciiva.com/7850/1018594-7850023.pdf?src-supplier=Element14; ComponentLink3URL: https://datasheet.ciiva.com/15215/getdatasheetpartid-328119-15215035.pdf?src-supplier=Verical; ComponentLink3Description: https://datasheet.ciiva.com/15215/getdatasheetpartid-328119-15215035.pdf?src-supplier=Verical; ComponentLink4URL: https://datasheet.ciiva.com/22661/1686128-22661342.pdf?src-supplier=Element14; ComponentLink4Description: https://datasheet.ciiva.com/22661/1686128-22661342.pdf?src-supplier=Element14; Supplier Part Number 1: 311-4.7KLRCT-ND
U7 = IC REG BOOST 8A VQFN: Boost Switching Regulator IC Positive Adjustable 2.2V 1 Output 7-VFQFN; Manufacturer: Texas Instruments; Supplier 1: Digi-Key; RoHS: No; Stock 1: 738; Pricing 1: 1=2.00000, 10=1.79600, 25=1.69440, 100=1.35550 (USD); Supplier Part Number 1: 296-TPS61022RWUTCT-ND
U8 = IC DCDC 0.8-6V 2A 8-uSIP: Non-Isolated PoL Module DC DC Converter 1 Output 0.8 ~ 6V 2A 2.5V - 6V Input; Manufacturer: Texas Instruments; Number of Outputs: 1; Min Output Voltage: 800mV; Switching Frequency: 2.4MHz; Synchronous Rectifier: Yes; Efficiency: 95%; Quiescent Current: 17uA; Output Type: Adjustable; Output Configuration: Positive; Supplier 1: Digi-Key; Supplier Part Number 1: 296-46279-1-ND; Stock 1: 31772; Pricing 1: 1 = 3.12000, 10 = 2.80400, 100 = 2.29770, 500 = 1.95602, 1000 = 1.64965 (USD); RoHS: Yes; Mount: Surface Mount; Case/Package: Module; Number of Pins: 8; Min Operating Temperature: -40°C; Max Operating Temperature: 125°C; Packaging: Tape and Reel; Min Input Voltage: 2.5V; Max Input Voltage: 6V; Max Output Voltage: 6V; Output Current: 2A; Output Voltage: 6V; Max Output Current: 2A; Operating Supply Voltage: 6V; Lead Free: Lead Free; ComponentLink1URL: http://www.ti.com/lit/ds/symlink/tps82084.pdf?src-supplier=Digi-Key; ComponentLink1Description: http://www.ti.com/lit/ds/symlink/tps82084.pdf?src-supplier=Digi-Key; ComponentLink2URL: http://www.ti.com/general/docs/lit/getliterature.tsp?genericPartNumber=TPS82084&&fileType=pdf&src-supplier=Avnet; ComponentLink2Description: http://www.ti.com/general/docs/lit/getliterature.tsp?genericPartNumber=TPS82084&&fileType=pdf&src-supplier=Avnet
U9 = IC REG INV CHARGE PUMP ADJ 8-WSON: Charge Pump Switching Regulator IC Negative Adjustable -1.5V 1 Output 250mA 8-WFDFN Exposed Pad; Manufacturer: Texas Instruments; Quiescent Current: 370uA; Supplier 1: Digi-Key; RoHS: No; Category: Voltage Regulators - Switching; Stock 1: 11534; Pricing 1: 1=1.63000, 10=1.46600, 25=1.38280, 100=1.10620, 250=0.96796, 500=0.94028, 1000=0.74670 (USD); Min Operating Temperature: -40°C; Max Operating Temperature: 85°C; Lead Free: Lead Free; ComponentLink1URL: http://www.ti.com/lit/ds/symlink/lm27761.pdf?src-supplier=Newark; ComponentLink1Description: http://www.ti.com/lit/ds/symlink/lm27761.pdf?src-supplier=Newark; ComponentLink2URL: http://www.ti.com/lit/ds/symlink/lm27761.pdf?src-supplier=Farnell; ComponentLink2Description: http://www.ti.com/lit/ds/symlink/lm27761.pdf?src-supplier=Farnell; ComponentLink3URL: http://www.ti.com/lit/ds/symlink/lm27761.pdf?src-supplier=Digi-Key; ComponentLink3Description: http://www.ti.com/lit/ds/symlink/lm27761.pdf?src-supplier=Digi-Key; ComponentLink4URL: http://www.ti.com/lit/gpn/lm27761?src-supplier=Mouser; ComponentLink4Description: http://www.ti.com/lit/gpn/lm27761?src-supplier=Mouser; Supplier Part Number 1: 296-44379-1-ND